# Altium project smart-watch.PrjPcb (part 1 of 2)
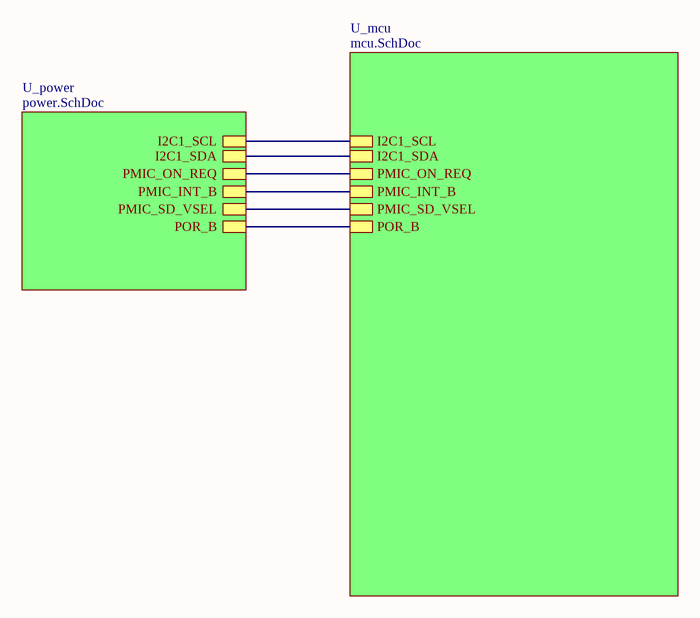
[diagram p0: smart-watch.SchDoc]
3 sheets, 82 parts. Net scope: hierarchical (ports join the sheet entries above them; power ports are global).
Board file: smart-watch.PcbDoc
Sheets:
  smart-watch.SchDoc
    U_mcu = mcu.SchDoc
    U_power = power.SchDoc

## Sheet smart-watch.SchDoc
size A4; SheetNumber: 1; SheetTotal: 3

### Sub-sheets
U_mcu = mcu.SchDoc: I2C1_SCL, I2C1_SDA, PMIC_ON_REQ, PMIC_INT_B, PMIC_SD_VSEL, POR_B
U_power = power.SchDoc: I2C1_SCL, I2C1_SDA, PMIC_ON_REQ, PMIC_INT_B, PMIC_SD_VSEL, POR_B

### Nets
I2C1_SCL: sheet U_mcu/I2C1_SCL, sheet U_power/I2C1_SCL
I2C1_SDA: sheet U_mcu/I2C1_SDA, sheet U_power/I2C1_SDA
NetR1_2: sheet U_mcu/PMIC_ON_REQ, sheet U_power/PMIC_ON_REQ
NetU1_AB3: sheet U_mcu/PMIC_SD_VSEL, sheet U_power/PMIC_SD_VSEL
NetU1_AB4: sheet U_mcu/PMIC_INT_B, sheet U_power/PMIC_INT_B
NetU1_Y3: sheet U_mcu/POR_B, sheet U_power/POR_B

### Notes on the sheet
- THIS DOCUMENT AND THE DATA DISCLOSED HEREIN OR
- HEREWITH IS THE PROPERTY OF ALTIUM LIMITED AND MAY
- DWG NO:
- REVISION
- REV:
- DESCRIPTION
- DATE
- APPROVED
- BE FREELY DISTRIBUTED IN WHOLE. NO RIGHTS ARE
- RESERVED OR EXPRESS OR IMPLIED WARANTEE GIVEN.
- ENG:
- APPROVALS
- PROJECT
- DSN:
- CHK:
- REFERENCE DOCUMENTS
- PROJECT REVISION:
- TITLE
- DOCUMENT REVISION:
- DESIGN ITEM:
- BOM:
- FAB DWG:
- PCB DWG:
- ASSY DWG:
- SCALE:
- A3
- SIZE
- CAGE CODE
- FILE NAME
- DWG NO.
- SHEET
- OF
- REV

## Sheet mcu.SchDoc
size A0; SheetNumber: 3; SheetTotal: 3
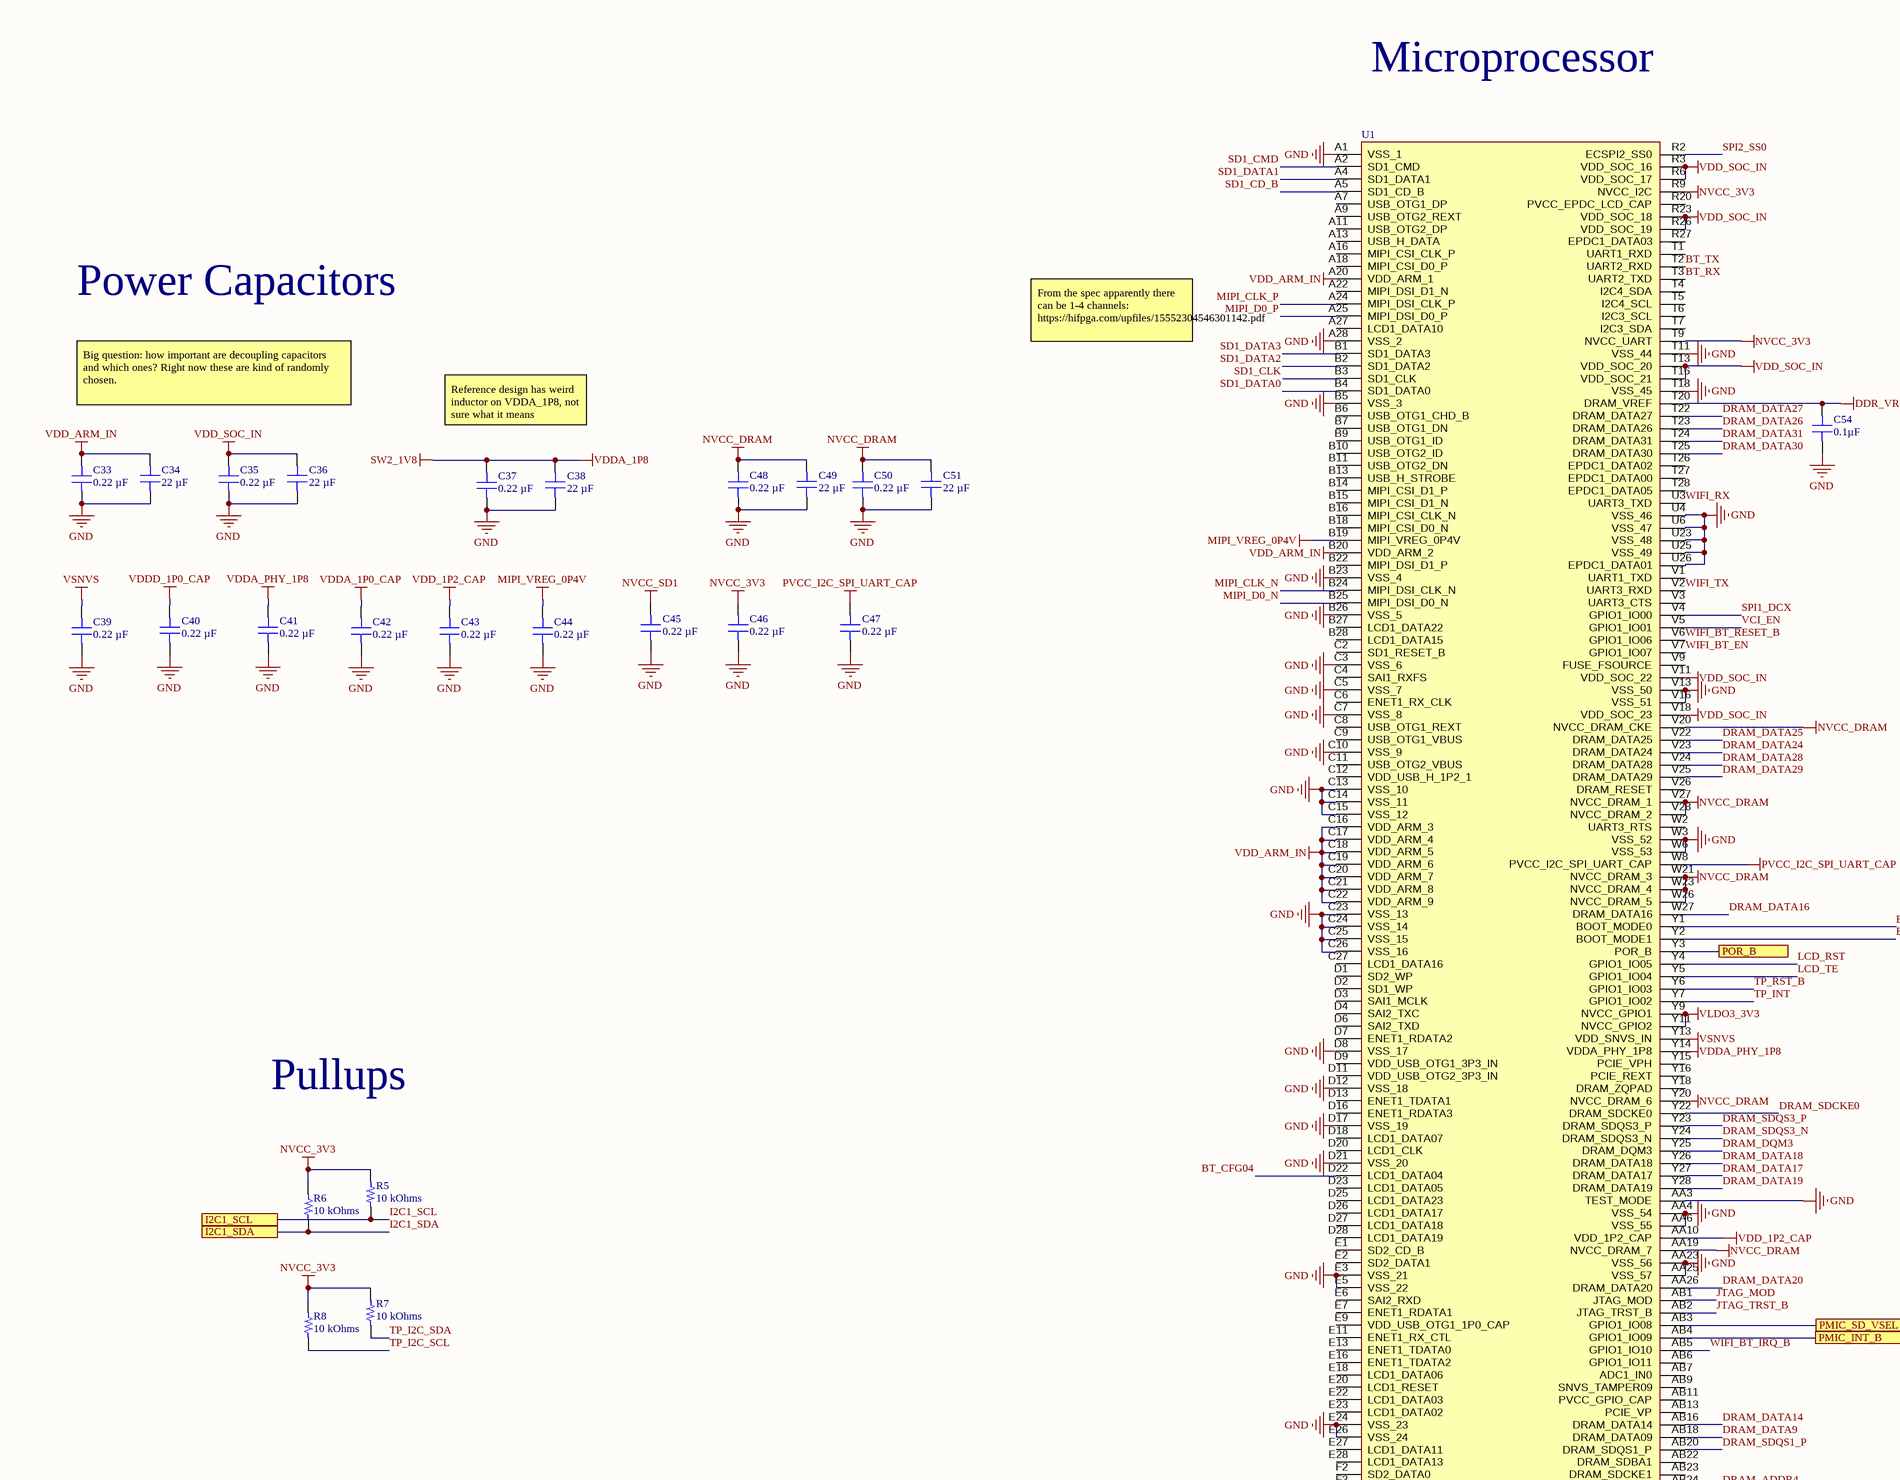
[diagram p1: mcu.SchDoc, top left]
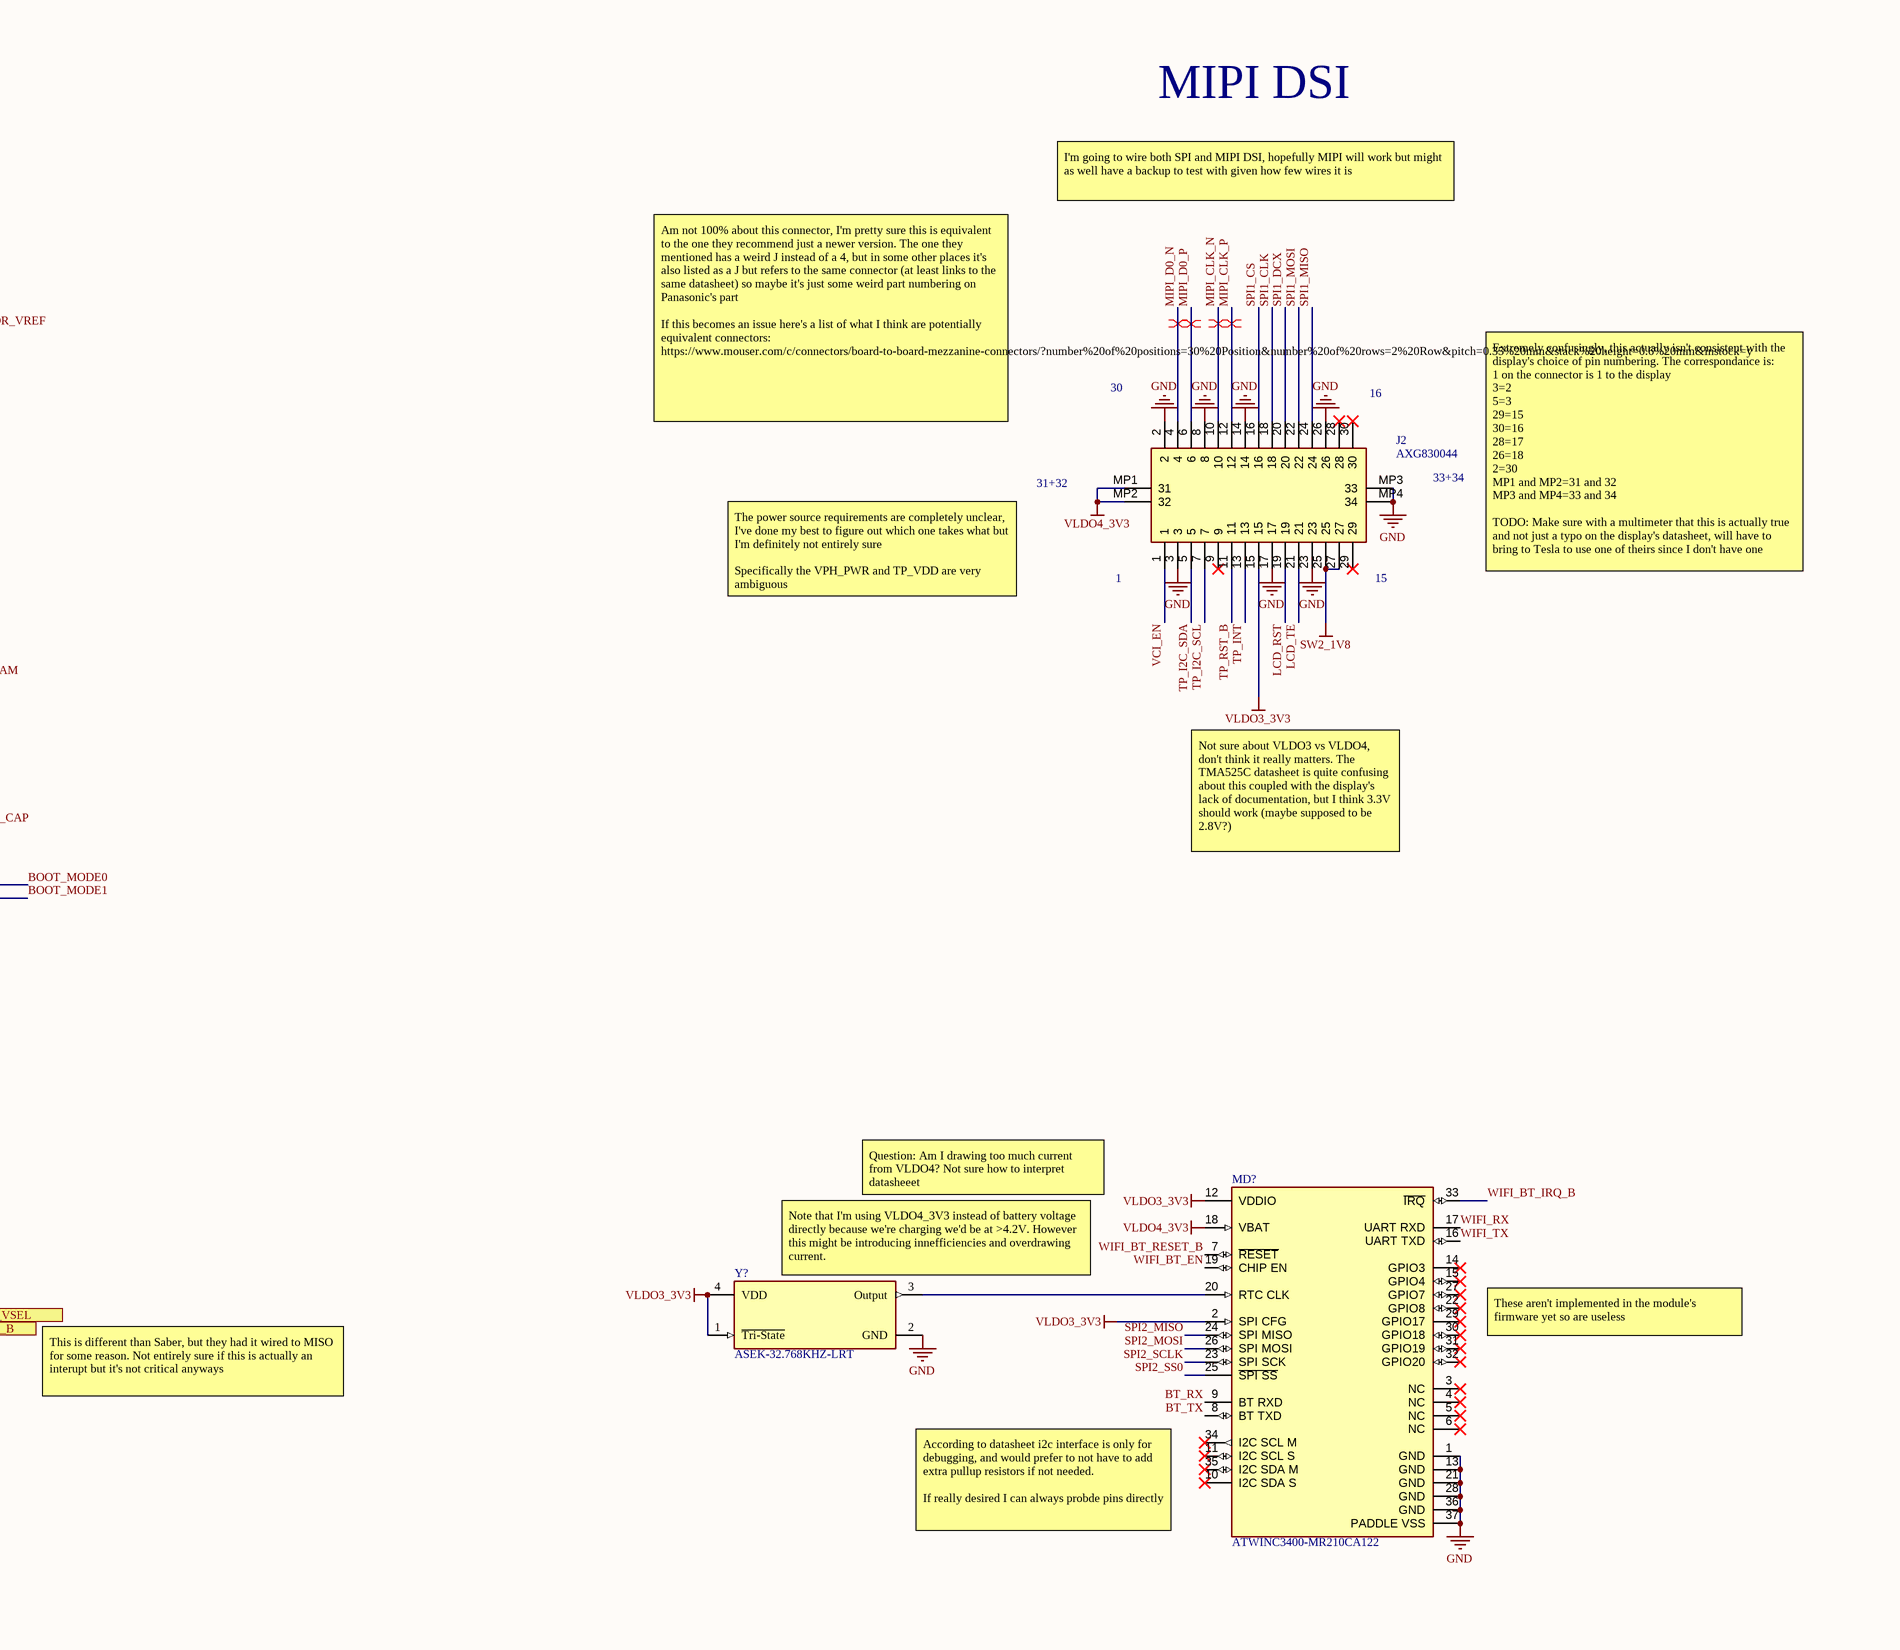
[diagram p2: mcu.SchDoc, top right]
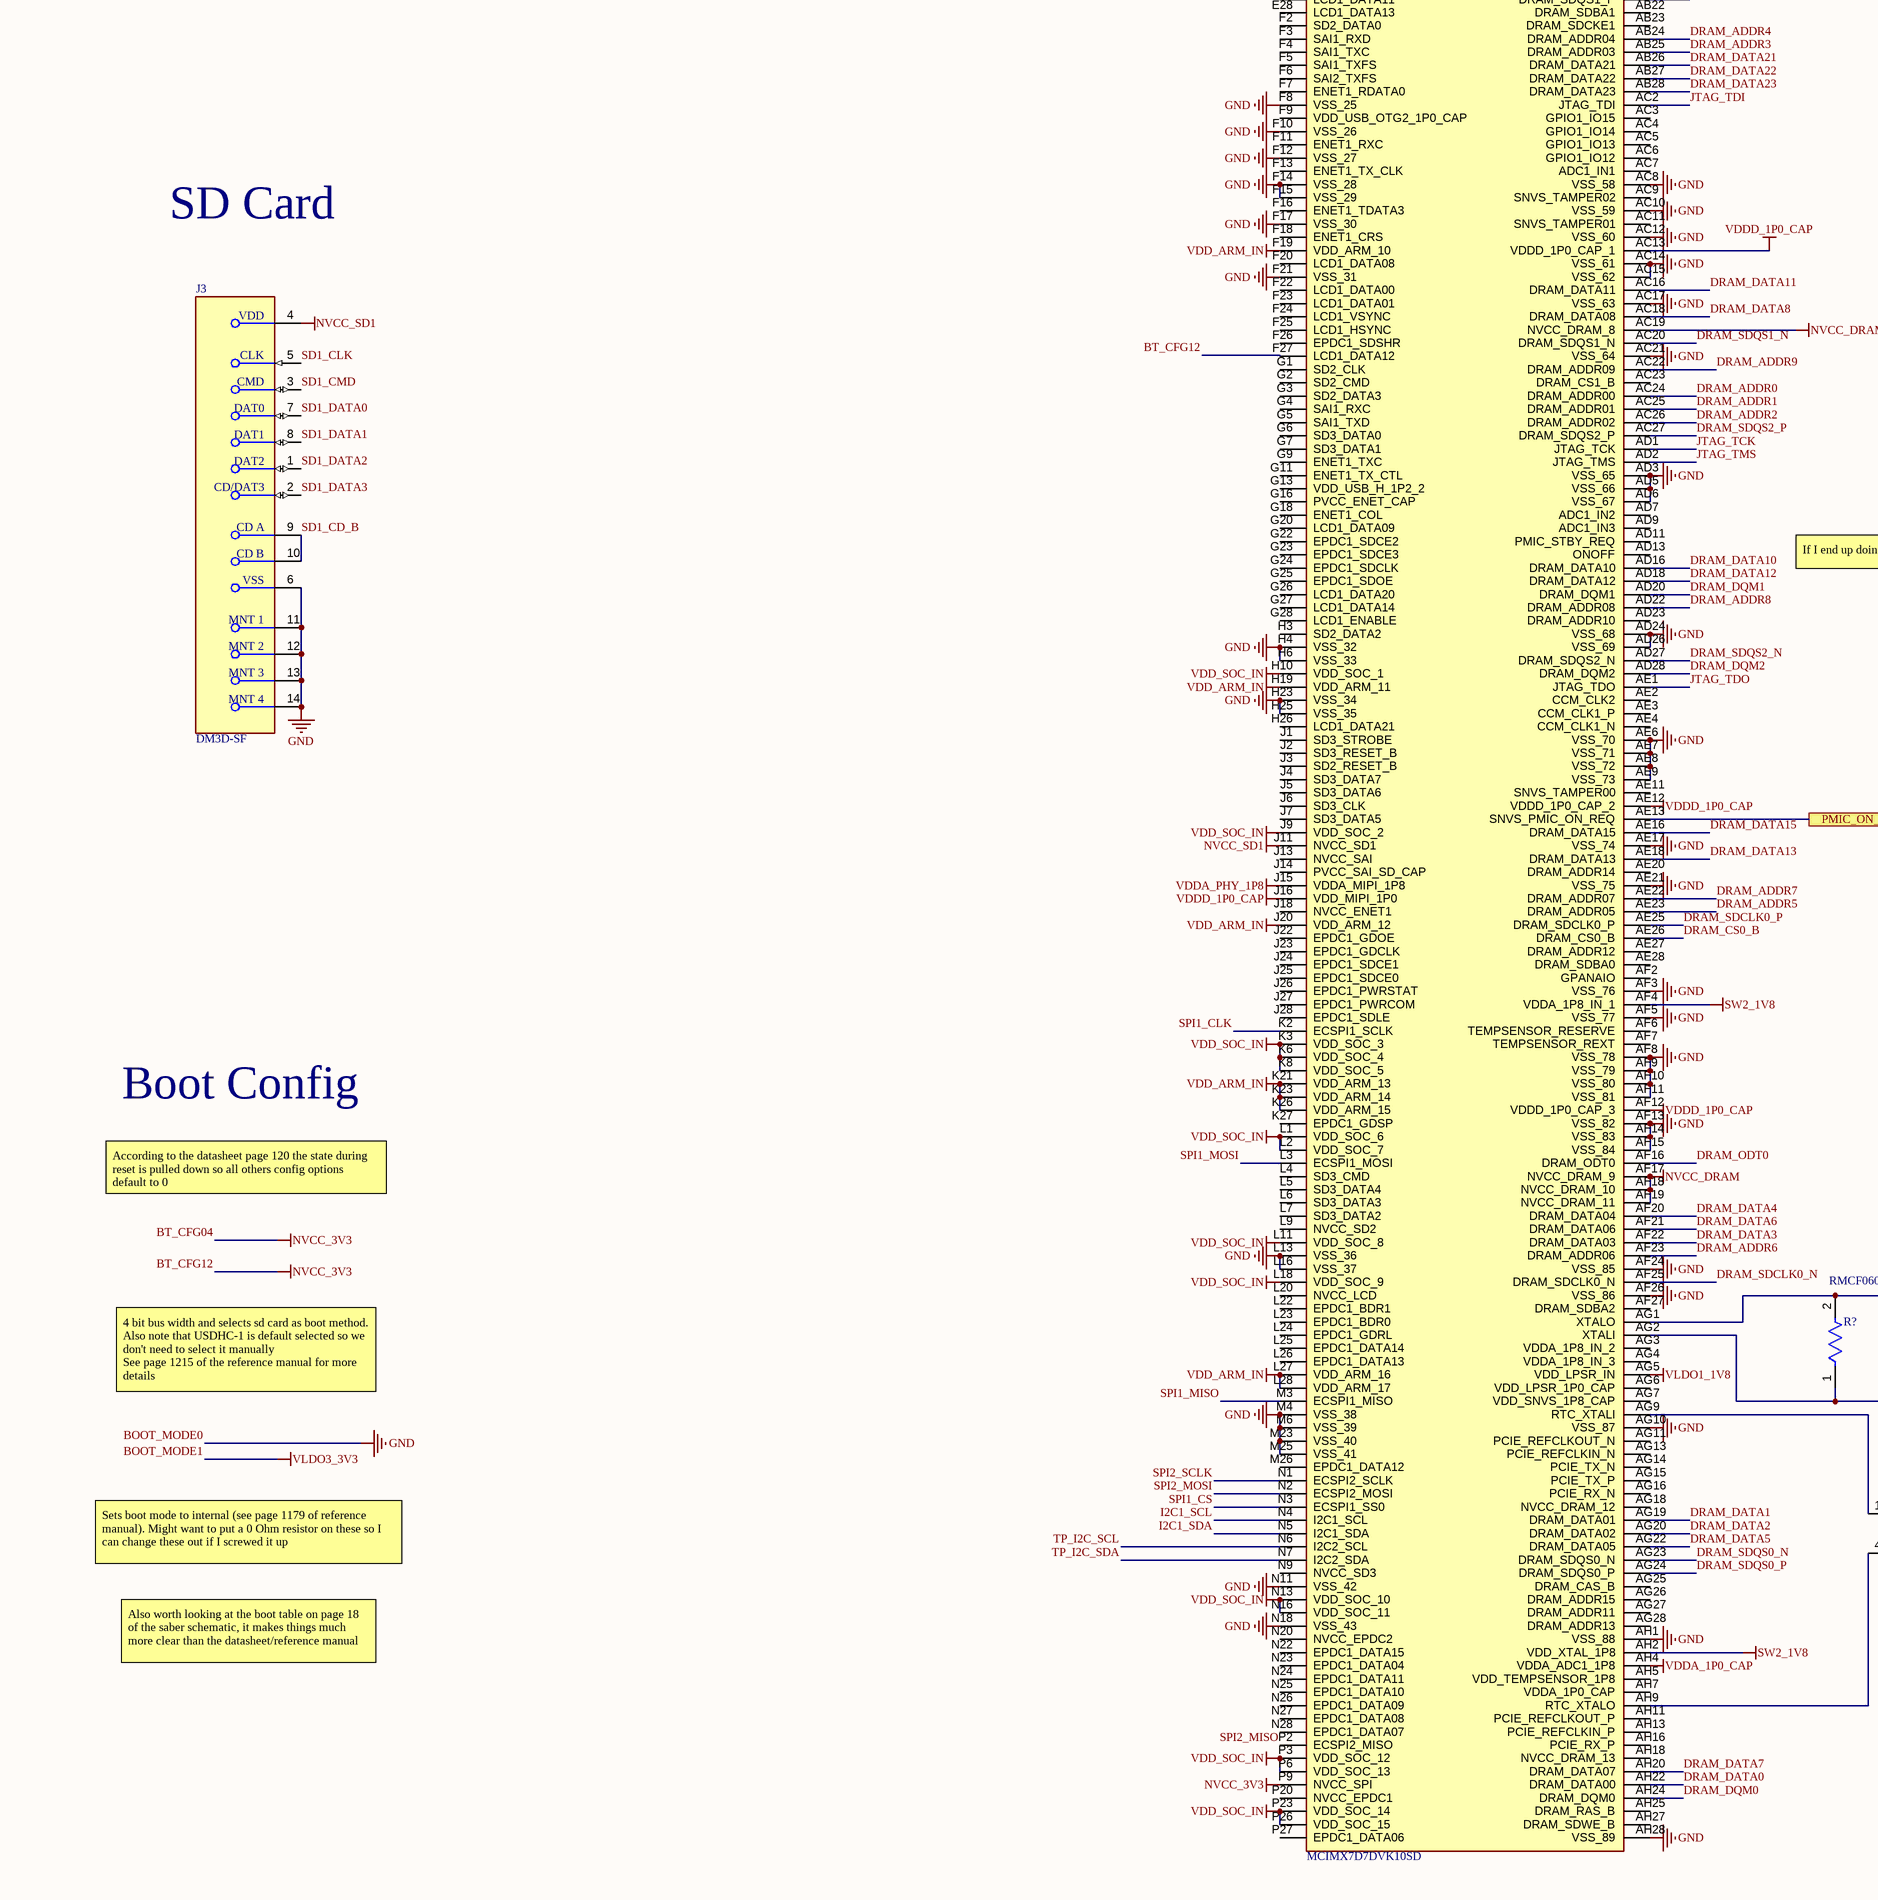
[diagram p3: mcu.SchDoc, bottom left]
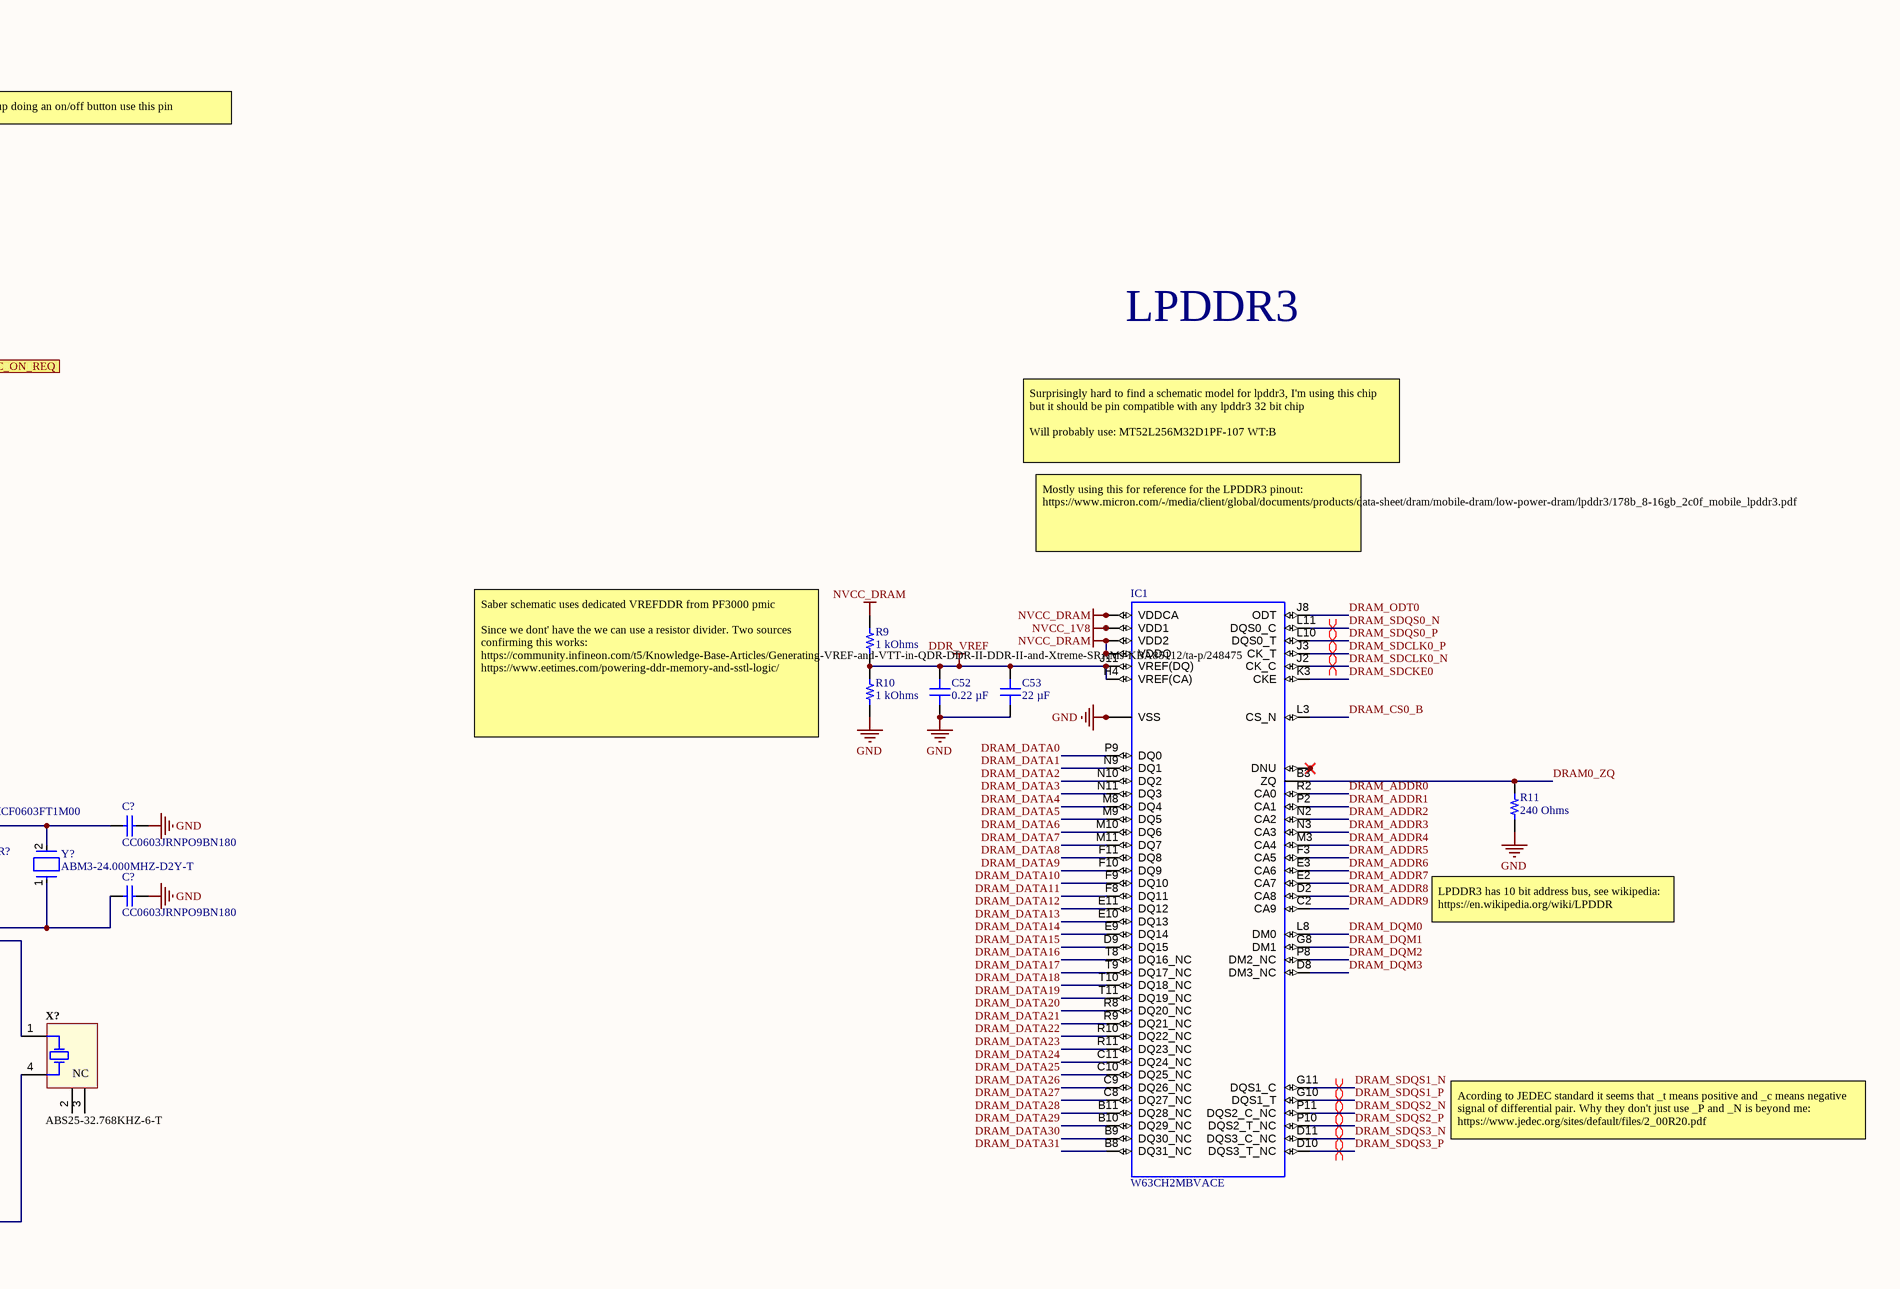
[diagram p4: mcu.SchDoc, bottom right]

### Parts
(Parts that share a designator on the sheet are numbered #1, #2 ... from top to bottom, then left to right.)
C33  0.22 µF  [CAP 0603_1608]
C34  22 µF  [CAP 0603_1608]
C35  0.22 µF  [CAP 0603_1608]
C36  22 µF  [CAP 0603_1608]
C37  0.22 µF  [CAP 0603_1608]
C38  22 µF  [CAP 0603_1608]
C39  0.22 µF  [CAP 0603_1608]
C40  0.22 µF  [CAP 0603_1608]
C41  0.22 µF  [CAP 0603_1608]
C42  0.22 µF  [CAP 0603_1608]
C43  0.22 µF  [CAP 0603_1608]
C44  0.22 µF  [CAP 0603_1608]
C45  0.22 µF  [CAP 0603_1608]
C46  0.22 µF  [CAP 0603_1608]
C47  0.22 µF  [CAP 0603_1608]
C48  0.22 µF  [CAP 0603_1608]
C49  22 µF  [CAP 0603_1608]
C50  0.22 µF  [CAP 0603_1608]
C51  22 µF  [CAP 0603_1608]
C52  0.22 µF  [CAP 0603_1608]
C53  22 µF  [CAP 0603_1608]
C54  0.1µF  [CAP 0603_1608]
C?#1  CC0603JRNPO9BN180  [CAPC1608X90X40LL10T20]
C?#2  CC0603JRNPO9BN180  [CAPC1608X90X40LL10T20]
IC1  W63CH2MBVACE  [W63CH2MBVACE]
J2  AXG830044  [AXG830044]
J3  DM3D-SF  [FP-DM3D-SF-MFG]
MD?  ATWINC3400-MR210CA122  [FP-ATWINC3400-MR210CA122-MFG]
R5  10 kOhms  [RES 0603_1608]
R6  10 kOhms  [RES 0603_1608]
R7  10 kOhms  [RES 0603_1608]
R8  10 kOhms  [RES 0603_1608]
R9  1 kOhms  [RES 0603_1608]
R10  1 kOhms  [RES 0603_1608]
R11  240 Ohms  [RES 0603_1608]
R?  RMCF0603FT1M00  [FP-RMCF0603-IPC_B]
U1  MCIMX7D7DVK10SD  [BGA488C40P28X28_1200X1200X110]
X?  ABS25-32.768KHZ-6-T  [ABRA-ABS25-4_V]
Y?#1  ASEK-32.768KHZ-LRT  [FP-ASEK-ASEAIG-MFG]
Y?#2  ABM3-24.000MHZ-D2Y-T  [FP-ABM3-MFG]

### Ports
I2C1_SCL, I2C1_SDA, PMIC_INT_B, PMIC_ON_REQ, PMIC_SD_VSEL, POR_B

### Nets
BOOT_MODE0: C33.1 C34.2 C35.1 C36.2 C37.1 C38.2 C39.1 C40.1 C41.1 C42.1 C43.1 C44.1 C45.1 C46.1 C47.1 C48.1 C49.2 C50.1 C51.2 C52.1 C53.2 C54.1 C?#1.2 C?#2.2 IC1.B2(VSS) IC1.B5(VSS) IC1.B6(VSS) IC1.B12(VSS) IC1.C3(VSS) IC1.C5(VSS) IC1.C6(VSS) IC1.D3(VSS) IC1.D12(VSS) IC1.E4(VSS) IC1.E5(VSS) IC1.E6(VSS) IC1.F4(VSS) IC1.F5(VSS) IC1.F6(VSS) IC1.F12(VSS) IC1.G3(VSS) IC1.G4(VSS) IC1.G6(VSS) IC1.G9(VSS) IC1.H2(VSS) IC1.H10(VSS) IC1.J4(VSS) IC1.J12(VSS) IC1.K2(VSS) IC1.K10(VSS) IC1.L6(VSS) IC1.L9(VSS) IC1.M4(VSS) IC1.M5(VSS) IC1.M6(VSS) IC1.M12(VSS) IC1.N4(VSS) IC1.N5(VSS) IC1.N6(VSS) IC1.P3(VSS) IC1.P12(VSS) IC1.R4(VSS) IC1.R5(VSS) IC1.R6(VSS) IC1.T2(VSS) IC1.T3(VSS) IC1.T4(VSS) IC1.T5(VSS) IC1.T6(VSS) IC1.T12(VSS) J2.2 J2.3 J2.8 J2.14 J2.17 J2.23 J2.26 J2.MP3(33) J2.MP4(34) J3.6(VSS) J3.11(MNT_1) J3.12(MNT_2) J3.13(MNT_3) J3.14(MNT_4) MD?.1(GND) MD?.13(GND) MD?.21(GND) MD?.28(GND) MD?.36(GND) MD?.37(PADDLE_VSS) R10.1 R11.1 U1.A1(VSS_1) U1.A28(VSS_2) U1.AA3(TEST_MODE) U1.AA4(VSS_54) U1.AA6(VSS_55) U1.AA23(VSS_56) U1.AA25(VSS_57) U1.AC8(VSS_58) U1.AC10(VSS_59) U1.AC12(VSS_60) U1.AC14(VSS_61) U1.AC15(VSS_62) U1.AC17(VSS_63) U1.AC21(VSS_64) U1.AD3(VSS_65) U1.AD5(VSS_66) U1.AD6(VSS_67) U1.AD24(VSS_68) U1.AD26(VSS_69) U1.AE6(VSS_70) U1.AE7(VSS_71) U1.AE8(VSS_72) U1.AE9(VSS_73) U1.AE17(VSS_74) U1.AE21(VSS_75) U1.AF3(VSS_76) U1.AF5(VSS_77) U1.AF8(VSS_78) U1.AF9(VSS_79) U1.AF10(VSS_80) U1.AF11(VSS_81) U1.AF13(VSS_82) U1.AF14(VSS_83) U1.AF15(VSS_84) U1.AF24(VSS_85) U1.AF26(VSS_86) U1.AG10(VSS_87) U1.AH1(VSS_88) U1.AH28(VSS_89) U1.B5(VSS_3) U1.B23(VSS_4) U1.B26(VSS_5) U1.C3(VSS_6) U1.C5(VSS_7) U1.C7(VSS_8) U1.C10(VSS_9) U1.C13(VSS_10) U1.C14(VSS_11) U1.C15(VSS_12) U1.C23(VSS_13) U1.C24(VSS_14) U1.C25(VSS_15) U1.C26(VSS_16) U1.D8(VSS_17) U1.D12(VSS_18) U1.D17(VSS_19) U1.D21(VSS_20) U1.E3(VSS_21) U1.E5(VSS_22) U1.E24(VSS_23) U1.E26(VSS_24) U1.F8(VSS_25) U1.F10(VSS_26) U1.F12(VSS_27) U1.F14(VSS_28) U1.F15(VSS_29) U1.F17(VSS_30) U1.F21(VSS_31) U1.H4(VSS_32) U1.H6(VSS_33) U1.H23(VSS_34) U1.H25(VSS_35) U1.L13(VSS_36) U1.L16(VSS_37) U1.M4(VSS_38) U1.M6(VSS_39) U1.M23(VSS_40) U1.M25(VSS_41) U1.N11(VSS_42) U1.N18(VSS_43) U1.T11(VSS_44) U1.T18(VSS_45) U1.U4(VSS_46) U1.U6(VSS_47) U1.U23(VSS_48) U1.U25(VSS_49) U1.U26(EPDC1_DATA01) U1.V13(VSS_50) U1.V16(VSS_51) U1.W3(VSS_52) U1.W6(VSS_53) U1.Y1(BOOT_MODE0) Y?#1.2(GND)  [also labelled GND]
BOOT_MODE1: J2.15 MD?.2(SPI_CFG) MD?.12(VDDIO) U1.Y2(BOOT_MODE1) U1.Y9(NVCC_GPIO1) U1.Y11(NVCC_GPIO2) Y?#1.1(~{Tri-State}) Y?#1.4(VDD)  [also labelled VLDO3_3V3]
BT_CFG04: C46.2 R5.2 R6.2 R7.2 R8.2 U1.D22(LCD1_DATA04) U1.F27(LCD1_DATA12) U1.P9(NVCC_SPI) U1.R9(NVCC_I2C) U1.T9(NVCC_UART)  [also labelled BT_CFG12, NVCC_3V3]
DDR_VREF: C52.2 C53.1 C54.2 IC1.H4(VREF(CA)) IC1.J11(VREF(DQ)) R9.1 R10.2 U1.T20(DRAM_VREF)
MIPI_VREG_0P4V: C44.2 U1.B19(MIPI_VREG_0P4V)
NVCC_1V8: C37.2 C38.1 IC1.A3(VDD1) IC1.A4(VDD1) IC1.A5(VDD1) IC1.A6(VDD1) IC1.A10(VDD1) IC1.U3(VDD1) IC1.U4(VDD1) IC1.U5(VDD1) IC1.U6(VDD1) IC1.U10(VDD1) J2.25 J2.27 U1.AF4(VDDA_1P8_IN_1) U1.AH2(VDD_XTAL_1P8)  [also labelled SW2_1V8, VDDA_1P8]
NVCC_DRAM: C48.2 C49.1 C50.2 C51.1 IC1.A8(VDD2) IC1.A9(VDD2) IC1.A11(VDDQ) IC1.C12(VDDQ) IC1.D4(VDD2) IC1.D5(VDD2) IC1.D6(VDD2) IC1.E8(VDDQ) IC1.E12(VDDQ) IC1.F2(VDDCA) IC1.G2(VDDCA) IC1.G5(VDD2) IC1.G12(VDDQ) IC1.H3(VDDCA) IC1.H5(VDD2) IC1.H6(VDD2) IC1.H8(VDDQ) IC1.H9(VDDQ) IC1.H11(VDDQ) IC1.H12(VDD2) IC1.J5(VDD2) IC1.J6(VDD2) IC1.J9(VDDQ) IC1.J10(VDDQ) IC1.K5(VDD2) IC1.K6(VDD2) IC1.K8(VDDQ) IC1.K11(VDDQ) IC1.K12(VDD2) IC1.L2(VDDCA) IC1.L5(VDD2) IC1.L12(VDDQ) IC1.M2(VDDCA) IC1.N8(VDDQ) IC1.N12(VDDQ) IC1.P4(VDD2) IC1.P5(VDD2) IC1.P6(VDD2) IC1.R12(VDDQ) IC1.U8(VDD2) IC1.U9(VDD2) IC1.U11(VDDQ) R9.2 U1.AA19(NVCC_DRAM_7) U1.AC19(NVCC_DRAM_8) U1.AF17(NVCC_DRAM_9) U1.AF18(NVCC_DRAM_10) U1.AF19(NVCC_DRAM_11) U1.V20(NVCC_DRAM_CKE) U1.V27(NVCC_DRAM_1) U1.V28(NVCC_DRAM_2) U1.W21(NVCC_DRAM_3) U1.W23(NVCC_DRAM_4) U1.W26(NVCC_DRAM_5) U1.Y20(NVCC_DRAM_6)
NVCC_SD1: C45.2 J3.4(VDD) U1.J11(NVCC_SD1)
PVCC_I2C_SPI_UART_CAP: C47.2 U1.W8(PVCC_I2C_SPI_UART_CAP)
VDD_1P2_CAP: C43.2 U1.AA10(VDD_1P2_CAP)
VDD_ARM_IN: C33.2 C34.1 C35.2 C36.1 U1.A20(VDD_ARM_1) U1.B20(VDD_ARM_2) U1.C16(VDD_ARM_3) U1.C17(VDD_ARM_4) U1.C18(VDD_ARM_5) U1.C19(VDD_ARM_6) U1.C20(VDD_ARM_7) U1.C21(VDD_ARM_8) U1.C22(VDD_ARM_9) U1.F19(VDD_ARM_10) U1.H10(VDD_SOC_1) U1.H19(VDD_ARM_11) U1.J9(VDD_SOC_2) U1.J20(VDD_ARM_12) U1.K3(VDD_SOC_3) U1.K6(VDD_SOC_4) U1.K8(VDD_SOC_5) U1.K21(VDD_ARM_13) U1.K23(VDD_ARM_14) U1.K26(VDD_ARM_15) U1.L1(VDD_SOC_6) U1.L2(VDD_SOC_7) U1.L11(VDD_SOC_8) U1.L18(VDD_SOC_9) U1.L27(VDD_ARM_16) U1.L28(VDD_ARM_17) U1.N13(VDD_SOC_10) U1.N16(VDD_SOC_11) U1.P3(VDD_SOC_12) U1.P6(VDD_SOC_13) U1.P23(VDD_SOC_14) U1.P26(VDD_SOC_15) U1.R3(VDD_SOC_16) U1.R6(VDD_SOC_17) U1.R23(VDD_SOC_18) U1.R26(VDD_SOC_19) U1.T13(VDD_SOC_20) U1.T16(VDD_SOC_21) U1.V11(VDD_SOC_22) U1.V18(VDD_SOC_23)  [also labelled VDD_SOC_IN]  [project net SW1_1V1]
VDDA_1P0_CAP: C42.2 U1.AH4(VDDA_ADC1_1P8)
VDDA_PHY_1P8: C41.2 U1.J15(VDDA_MIPI_1P8) U1.Y14(VDDA_PHY_1P8)
VDDD_1P0_CAP: C40.2 U1.AC13(VDDD_1P0_CAP_1) U1.AE12(VDDD_1P0_CAP_2) U1.AF12(VDDD_1P0_CAP_3) U1.J16(VDD_MIPI_1P0)
VLDO1_1V8: U1.AG5(VDD_LPSR_IN)
VLDO4_3V3: J2.MP1(31) J2.MP2(32) MD?.18(VBAT)
VSNVS: C39.2 U1.Y13(VDD_SNVS_IN)
BT_RX: MD?.9(BT_RXD) U1.T3(UART2_TXD)
BT_TX: MD?.8(BT_TXD) U1.T2(UART2_RXD)
DRAM0_ZQ: IC1.B3(ZQ) R11.2
DRAM_ADDR0: IC1.R2(CA0) U1.AC24(DRAM_ADDR00)
DRAM_ADDR1: IC1.P2(CA1) U1.AC25(DRAM_ADDR01)
DRAM_ADDR2: IC1.N2(CA2) U1.AC26(DRAM_ADDR02)
DRAM_ADDR3: IC1.N3(CA3) U1.AB25(DRAM_ADDR03)
DRAM_ADDR4: IC1.M3(CA4) U1.AB24(DRAM_ADDR04)
DRAM_ADDR5: IC1.F3(CA5) U1.AE23(DRAM_ADDR05)
DRAM_ADDR6: IC1.E3(CA6) U1.AF23(DRAM_ADDR06)
DRAM_ADDR7: IC1.E2(CA7) U1.AE22(DRAM_ADDR07)
DRAM_ADDR8: IC1.D2(CA8) U1.AD22(DRAM_ADDR08)
DRAM_ADDR9: IC1.C2(CA9) U1.AC22(DRAM_ADDR09)
DRAM_CS0_B: IC1.L3(CS_N) U1.AE26(DRAM_CS0_B)
DRAM_DATA0: IC1.P9(DQ0) U1.AH22(DRAM_DATA00)
DRAM_DATA1: IC1.N9(DQ1) U1.AG19(DRAM_DATA01)
DRAM_DATA2: IC1.N10(DQ2) U1.AG20(DRAM_DATA02)
DRAM_DATA3: IC1.N11(DQ3) U1.AF22(DRAM_DATA03)
DRAM_DATA4: IC1.M8(DQ4) U1.AF20(DRAM_DATA04)
DRAM_DATA5: IC1.M9(DQ5) U1.AG22(DRAM_DATA05)
DRAM_DATA6: IC1.M10(DQ6) U1.AF21(DRAM_DATA06)
DRAM_DATA7: IC1.M11(DQ7) U1.AH20(DRAM_DATA07)
DRAM_DATA8: IC1.F11(DQ8) U1.AC18(DRAM_DATA08)
DRAM_DATA9: IC1.F10(DQ9) U1.AB18(DRAM_DATA09)
DRAM_DATA10: IC1.F9(DQ10) U1.AD16(DRAM_DATA10)
DRAM_DATA11: IC1.F8(DQ11) U1.AC16(DRAM_DATA11)
DRAM_DATA12: IC1.E11(DQ12) U1.AD18(DRAM_DATA12)
DRAM_DATA13: IC1.E10(DQ13) U1.AE18(DRAM_DATA13)
DRAM_DATA14: IC1.E9(DQ14) U1.AB16(DRAM_DATA14)
DRAM_DATA15: IC1.D9(DQ15) U1.AE16(DRAM_DATA15)
DRAM_DATA16: IC1.T8(DQ16_NC) U1.W27(DRAM_DATA16)
DRAM_DATA17: IC1.T9(DQ17_NC) U1.Y27(DRAM_DATA17)
DRAM_DATA18: IC1.T10(DQ18_NC) U1.Y26(DRAM_DATA18)
DRAM_DATA19: IC1.T11(DQ19_NC) U1.Y28(DRAM_DATA19)
DRAM_DATA20: IC1.R8(DQ20_NC) U1.AA26(DRAM_DATA20)
DRAM_DATA21: IC1.R9(DQ21_NC) U1.AB26(DRAM_DATA21)
DRAM_DATA22: IC1.R10(DQ22_NC) U1.AB27(DRAM_DATA22)
DRAM_DATA23: IC1.R11(DQ23_NC) U1.AB28(DRAM_DATA23)
DRAM_DATA24: IC1.C11(DQ24_NC) U1.V23(DRAM_DATA24)
DRAM_DATA25: IC1.C10(DQ25_NC) U1.V22(DRAM_DATA25)
DRAM_DATA26: IC1.C9(DQ26_NC) U1.T23(DRAM_DATA26)
DRAM_DATA27: IC1.C8(DQ27_NC) U1.T22(DRAM_DATA27)
DRAM_DATA28: IC1.B11(DQ28_NC) U1.V24(DRAM_DATA28)
DRAM_DATA29: IC1.B10(DQ29_NC) U1.V25(DRAM_DATA29)
DRAM_DATA30: IC1.B9(DQ30_NC) U1.T25(DRAM_DATA30)
DRAM_DATA31: IC1.B8(DQ31_NC) U1.T24(DRAM_DATA31)
DRAM_DQM0: IC1.L8(DM0) U1.AH24(DRAM_DQM0)
DRAM_DQM1: IC1.G8(DM1) U1.AD20(DRAM_DQM1)
DRAM_DQM2: IC1.P8(DM2_NC) U1.AD28(DRAM_DQM2)
DRAM_DQM3: IC1.D8(DM3_NC) U1.Y25(DRAM_DQM3)
DRAM_ODT0: IC1.J8(ODT) U1.AF16(DRAM_ODT0)
DRAM_SDCKE0: IC1.K3(CKE) U1.Y22(DRAM_SDCKE0)
DRAM_SDCLK0_N: IC1.J2(CK_C) U1.AF25(DRAM_SDCLK0_N)
DRAM_SDCLK0_P: IC1.J3(CK_T) U1.AE25(DRAM_SDCLK0_P)
DRAM_SDQS0_N: IC1.L11(DQS0_C) U1.AG23(DRAM_SDQS0_N)
DRAM_SDQS0_P: IC1.L10(DQS0_T) U1.AG24(DRAM_SDQS0_P)
DRAM_SDQS1_N: IC1.G11(DQS1_C) U1.AC20(DRAM_SDQS1_N)
DRAM_SDQS1_P: IC1.G10(DQS1_T) U1.AB20(DRAM_SDQS1_P)
DRAM_SDQS2_N: IC1.P11(DQS2_C_NC) U1.AD27(DRAM_SDQS2_N)
DRAM_SDQS2_P: IC1.P10(DQS2_T_NC) U1.AC27(DRAM_SDQS2_P)
DRAM_SDQS3_N: IC1.D11(DQS3_C_NC) U1.Y24(DRAM_SDQS3_N)
DRAM_SDQS3_P: IC1.D10(DQS3_T_NC) U1.Y23(DRAM_SDQS3_P)
I2C1_SCL: R5.1 U1.N4(I2C1_SCL) ; port I2C1_SCL
I2C1_SDA: R6.1 U1.N5(I2C1_SDA) ; port I2C1_SDA
JTAG_MOD: U1.AB1(JTAG_MOD)
JTAG_TCK: U1.AD1(JTAG_TCK)
JTAG_TDI: U1.AC2(JTAG_TDI)
JTAG_TDO: U1.AE1(JTAG_TDO)
JTAG_TMS: U1.AD2(JTAG_TMS)
JTAG_TRST_B: U1.AB2(JTAG_TRST_B)
LCD_RST: J2.19 U1.Y4(GPIO1_IO05)
LCD_TE: J2.21 U1.Y5(GPIO1_IO04)
MIPI_CLK_N: J2.10 U1.B24(MIPI_DSI_CLK_N)
MIPI_CLK_P: J2.12 U1.A24(MIPI_DSI_CLK_P)
MIPI_D0_N: J2.4 U1.B25(MIPI_DSI_D0_N)
MIPI_D0_P: J2.6 U1.A25(MIPI_DSI_D0_P)
SD1_CD_B: J3.9(CD_A) J3.10(CD_B) U1.A5(SD1_CD_B)
SD1_CLK: J3.5(CLK) U1.B3(SD1_CLK)
SD1_CMD: J3.3(CMD) U1.A2(SD1_CMD)
SD1_DATA0: J3.7(DAT0) U1.B4(SD1_DATA0)
SD1_DATA1: J3.8(DAT1) U1.A4(SD1_DATA1)
SD1_DATA2: J3.1(DAT2) U1.B2(SD1_DATA2)
SD1_DATA3: J3.2(CD/DAT3) U1.B1(SD1_DATA3)
SPI1_CLK: J2.18 U1.K2(ECSPI1_SCLK)
SPI1_CS: J2.16 U1.N3(ECSPI1_SS0)
SPI1_DCX: J2.20 U1.V4(GPIO1_IO00)
SPI1_MISO: J2.24 U1.M3(ECSPI1_MISO)
SPI1_MOSI: J2.22 U1.L3(ECSPI1_MOSI)
SPI2_MISO: MD?.24(SPI_MISO) U1.P2(ECSPI2_MISO)
SPI2_MOSI: MD?.26(SPI_MOSI) U1.N2(ECSPI2_MOSI)
SPI2_SCLK: MD?.23(SPI_SCK) U1.N1(ECSPI2_SCLK)
SPI2_SS0: MD?.25(~{SPI_SS}) U1.R2(ECSPI2_SS0)
TP_I2C_SCL: J2.7 R8.1 U1.N6(I2C2_SCL)
TP_I2C_SDA: J2.5 R7.1 U1.N7(I2C2_SDA)
TP_INT: J2.13 U1.Y7(GPIO1_IO02)
TP_RST_B: J2.11 U1.Y6(GPIO1_IO03)
VCI_EN: J2.1 U1.V5(GPIO1_IO01)
WIFI_BT_EN: MD?.19(CHIP_EN) U1.V7(GPIO1_IO07)
WIFI_BT_IRQ_B: MD?.33(~{IRQ}) U1.AB5(GPIO1_IO10)
WIFI_BT_RESET_B: MD?.7(~{RESET}) U1.V6(GPIO1_IO06)
WIFI_RX: MD?.17(UART_RXD) U1.U3(UART3_TXD)
WIFI_TX: MD?.16(UART_TXD) U1.V2(UART3_RXD)
NetC?#1_1: C?#1.1 R?.2 U1.AG1(XTALO) Y?#2.2
NetC?#2_1: C?#2.1 R?.1 U1.AG2(XTALI) Y?#2.1
NetIC1_A1: IC1.A1(DNU) IC1.A2(DNU) IC1.A12(DNU) IC1.A13(DNU) IC1.B1(DNU) IC1.B13(DNU) IC1.T1(DNU) IC1.T13(DNU) IC1.U1(DNU) IC1.U2(DNU) IC1.U12(DNU) IC1.U13(DNU)
NetMD?_20: MD?.20(RTC_CLK) Y?#1.3(Output)
NetR1_2: U1.AE13(SNVS_PMIC_ON_REQ) ; port PMIC_ON_REQ
NetU1_AB3: U1.AB3(GPIO1_IO08) ; port PMIC_SD_VSEL
NetU1_AB4: U1.AB4(GPIO1_IO09) ; port PMIC_INT_B
NetU1_AG9: U1.AG9(RTC_XTALI) X?.1(X1)
NetU1_AH9: U1.AH9(RTC_XTALO) X?.4(X2)
NetU1_Y3: U1.Y3(POR_B) ; port POR_B

Not connected (* = marked no-connect by the designer): J2 9* 28* 29* 30*; MD? 3(NC)* 4(NC)* 5(NC)* 6(NC)* 10(I2C_SDA_S)* 11(I2C_SCL_S)* 14(GPIO3)* 15(GPIO4)* 22(GPIO8)* 27(GPIO7)* 29(GPIO17)* 30(GPIO18)* 31(GPIO19)* 32(GPIO20)* 34(I2C_SCL_M)* 35(I2C_SDA_M)*; U1 A7(USB_OTG1_DP) A9(USB_OTG2_REXT) A11(USB_OTG2_DP) A13(USB_H_DATA) A16(MIPI_CSI_CLK_P) A18(MIPI_CSI_D0_P) A22(MIPI_DSI_D1_N) A27(LCD1_DATA10) AB6(GPIO1_IO11) AB7(ADC1_IN0) AB9(SNVS_TAMPER09) AB11(PVCC_GPIO_CAP) AB13(PCIE_VP) AB22(DRAM_SDBA1) AB23(DRAM_SDCKE1) AC3(GPIO1_IO15) AC4(GPIO1_IO14) AC5(GPIO1_IO13) AC6(GPIO1_IO12) AC7(ADC1_IN1) AC9(SNVS_TAMPER02) AC11(SNVS_TAMPER01) AC23(DRAM_CS1_B) AD7(ADC1_IN2) AD9(ADC1_IN3) AD11(PMIC_STBY_REQ) AD13(ONOFF) AD23(DRAM_ADDR10) AE2(CCM_CLK2) AE3(CCM_CLK1_P) AE4(CCM_CLK1_N) AE11(SNVS_TAMPER00) AE20(DRAM_ADDR14) AE27(DRAM_ADDR12) AE28(DRAM_SDBA0) AF2(GPANAIO) AF6(TEMPSENSOR_RESERVE) AF7(TEMPSENSOR_REXT) AF27(DRAM_SDBA2) AG3(VDDA_1P8_IN_2) AG4(VDDA_1P8_IN_3) AG6(VDD_LPSR_1P0_CAP) AG7(VDD_SNVS_1P8_CAP) AG11(PCIE_REFCLKOUT_N) AG13(PCIE_REFCLKIN_N) AG14(PCIE_TX_N) AG15(PCIE_TX_P) AG16(PCIE_RX_N) AG18(NVCC_DRAM_12) AG25(DRAM_CAS_B) AG26(DRAM_ADDR15) AG27(DRAM_ADDR11) AG28(DRAM_ADDR13) AH5(VDD_TEMPSENSOR_1P8) AH7(VDDA_1P0_CAP) AH11(PCIE_REFCLKOUT_P) AH13(PCIE_REFCLKIN_P) AH16(PCIE_RX_P) AH18(NVCC_DRAM_13) AH25(DRAM_RAS_B) AH27(DRAM_SDWE_B) B6(USB_OTG1_CHD_B) B7(USB_OTG1_DN) B9(USB_OTG1_ID) B10(USB_OTG2_ID) B11(USB_OTG2_DN) B13(USB_H_STROBE) B14(MIPI_CSI_D1_P) B15(MIPI_CSI_D1_N) B16(MIPI_CSI_CLK_N) B18(MIPI_CSI_D0_N) B22(MIPI_DSI_D1_P) B27(LCD1_DATA22) B28(LCD1_DATA15) C2(SD1_RESET_B) C4(SAI1_RXFS) C6(ENET1_RX_CLK) C8(USB_OTG1_REXT) C9(USB_OTG1_VBUS) C11(USB_OTG2_VBUS) C12(VDD_USB_H_1P2_1) C27(LCD1_DATA16) D1(SD2_WP) D2(SD1_WP) D3(SAI1_MCLK) D4(SAI2_TXC) D6(SAI2_TXD) D7(ENET1_RDATA2) D9(VDD_USB_OTG1_3P3_IN) D11(VDD_USB_OTG2_3P3_IN) D13(ENET1_TDATA1) D16(ENET1_RDATA3) D18(LCD1_DATA07) D20(LCD1_CLK) D23(LCD1_DATA05) D25(LCD1_DATA23) D26(LCD1_DATA17) D27(LCD1_DATA18) D28(LCD1_DATA19) E1(SD2_CD_B) E2(SD2_DATA1) E6(SAI2_RXD) E7(ENET1_RDATA1) E9(VDD_USB_OTG1_1P0_CAP) E11(ENET1_RX_CTL) E13(ENET1_TDATA0) E16(ENET1_TDATA2) E18(LCD1_DATA06) E20(LCD1_RESET) E22(LCD1_DATA03) E23(LCD1_DATA02) E27(LCD1_DATA11) E28(LCD1_DATA13) F2(SD2_DATA0) F3(SAI1_RXD) F4(SAI1_TXC) F5(SAI1_TXFS) F6(SAI2_TXFS) F7(ENET1_RDATA0) F9(VDD_USB_OTG2_1P0_CAP) F11(ENET1_RXC) F13(ENET1_TX_CLK) F16(ENET1_TDATA3) F18(ENET1_CRS) F20(LCD1_DATA08) F22(LCD1_DATA00) F23(LCD1_DATA01) F24(LCD1_VSYNC) F25(LCD1_HSYNC) F26(EPDC1_SDSHR) G1(SD2_CLK) G2(SD2_CMD) G3(SD2_DATA3) G4(SAI1_RXC) G5(SAI1_TXD) G6(SD3_DATA0) G7(SD3_DATA1) G9(ENET1_TXC) G11(ENET1_TX_CTL) G13(VDD_USB_H_1P2_2) G16(PVCC_ENET_CAP) G18(ENET1_COL) G20(LCD1_DATA09) G22(EPDC1_SDCE2) G23(EPDC1_SDCE3) G24(EPDC1_SDCLK) G25(EPDC1_SDOE) G26(LCD1_DATA20) G27(LCD1_DATA14) G28(LCD1_ENABLE) H3(SD2_DATA2) H26(LCD1_DATA21) J1(SD3_STROBE) J2(SD3_RESET_B) J3(SD2_RESET_B) J4(SD3_DATA7) J5(SD3_DATA6) J6(SD3_CLK) J7(SD3_DATA5) J13(NVCC_SAI) J14(PVCC_SAI_SD_CAP) J18(NVCC_ENET1) J22(EPDC1_GDOE) J23(EPDC1_GDCLK) J24(EPDC1_SDCE1) J25(EPDC1_SDCE0) J26(EPDC1_PWRSTAT) J27(EPDC1_PWRCOM) J28(EPDC1_SDLE) K27(EPDC1_GDSP) L4(SD3_CMD) L5(SD3_DATA4) L6(SD3_DATA3) L7(SD3_DATA2) L9(NVCC_SD2) L20(NVCC_LCD) L22(EPDC1_BDR1) L23(EPDC1_BDR0) L24(EPDC1_GDRL) L25(EPDC1_DATA14) L26(EPDC1_DATA13) M26(EPDC1_DATA12) N9(NVCC_SD3) N20(NVCC_EPDC2) N22(EPDC1_DATA15) N23(EPDC1_DATA04) N24(EPDC1_DATA11) N25(EPDC1_DATA10) N26(EPDC1_DATA09) N27(EPDC1_DATA08) N28(EPDC1_DATA07) P20(NVCC_EPDC1) P27(EPDC1_DATA06) R20(PVCC_EPDC_LCD_CAP) R27(EPDC1_DATA03) T1(UART1_RXD) T4(I2C4_SDA) T5(I2C4_SCL) T6(I2C3_SCL) T7(I2C3_SDA) T26(EPDC1_DATA02) T27(EPDC1_DATA00) T28(EPDC1_DATA05) V1(UART1_TXD) V3(UART3_CTS) V9(FUSE_FSOURCE) V26(DRAM_RESET) W2(UART3_RTS) Y15(PCIE_VPH) Y16(PCIE_REXT) Y18(DRAM_ZQPAD); X? 2(NC) 3(NC)

### Layout directives
differential pair: DRAM_SDCLK0_N, DRAM_SDCLK0_P, DRAM_SDQS0_N, DRAM_SDQS0_P, DRAM_SDQS1_N, DRAM_SDQS1_P, DRAM_SDQS2_N, DRAM_SDQS2_P, DRAM_SDQS3_N, DRAM_SDQS3_P, MIPI_CLK_N, MIPI_CLK_P, MIPI_D0_N, MIPI_D0_P

### Notes on the sheet
- Microprocessor
- MIPI DSI
- Power Capacitors
- From the spec apparently there can be 1-4 channels:
  https://hifpga.com/upfiles/15552304546301142.pdf
- I'm going to wire both SPI and MIPI DSI, hopefully MIPI will work but might as well have a backup to test with given how few wires it is
- Big question: how important are decoupling capacitors and which ones? Right now these are kind of randomly chosen.
- Reference design has weird inductor on VDDA_1P8, not sure what it means
- Am not 100% about this connector, I'm pretty sure this is equivalent to the one they recommend just a newer version. The one they mentioned has a weird J instead of a 4, but in some other places it's also listed as a J but refers to the same connector (at least links to the same datasheet) so maybe it's just some weird part numbering on Panasonic's part
  If this becomes an issue here's a list of what I think are potentially equivalent connectors:
  https://www.mouser.com/c/connectors/board-to-board-mezzanine-connectors/?number%20of%20positions=30%20Position&number%20of%20rows=2%20Row&pitch=0.35%20mm&stack%20height=0.6%20mm&instock=y
- 30
- (near J2) 16
- 31+32
- 33+34
- The power source requirements are completely unclear, I've done my best to figure out which one takes what but I'm definitely not entirely sure
  Specifically the VPH_PWR and TP_VDD are very ambiguous
- (near J2) 1
- (near J2) 15
- Extremely confusingly, this actually isn't consistent with the display's choice of pin numbering. The correspondance is:
  1 on the connector is 1 to the display
  3=2
  5=3
  29=15
  30=16
  28=17
  26=18
  2=30
  MP1 and MP2=31 and 32
  MP3 and MP4=33 and 34
  TODO: Make sure with a multimeter that this is actually true and not just a typo on the display's datasheet, will have to bring to Tesla to use one of theirs since I don't have one
- Not sure about VLDO3 vs VLDO4, don't think it really matters. The TMA525C datasheet is quite confusing about this coupled with the display's lack of documentation, but I think 3.3V should work (maybe supposed to be 2.8V?)
- Pullups
- Question: Am I drawing too much current from VLDO4? Not sure how to interpret datasheeet
- (near Y?#1) Note that I'm using VLDO4_3V3 instead of battery voltage directly because we're charging we'd be at >4.2V. However this might be introducing innefficiencies and overdrawing current.
- This is different than Saber, but they had it wired to MISO for some reason. Not entirely sure if this is actually an interupt but it's not critical anyways
- These aren't implemented in the module's firmware yet so are useless
- According to datasheet i2c interface is only for debugging, and would prefer to not have to add extra pullup resistors if not needed.
  If really desired I can always probde pins directly
- SD Card
- If I end up doing an on/off button use this pin
- LPDDR3
- Surprisingly hard to find a schematic model for lpddr3, I'm using this chip but it should be pin compatible with any lpddr3 32 bit chip
  Will probably use: MT52L256M32D1PF-107 WT:B
- Mostly using this for reference for the LPDDR3 pinout:
  https://www.micron.com/-/media/client/global/documents/products/data-sheet/dram/mobile-dram/low-power-dram/lpddr3/178b_8-16gb_2c0f_mobile_lpddr3.pdf
- Boot Config
- According to the datasheet page 120 the state during reset is pulled down so all others config options default to 0
- Saber schematic uses dedicated VREFDDR from PF3000 pmic
  Since we dont' have the we can use a resistor divider. Two sources confirming this works:
  https://community.infineon.com/t5/Knowledge-Base-Articles/Generating-VREF-and-VTT-in-QDR-DDR-II-DDR-II-and-Xtreme-SRAMs-KBA85112/ta-p/248475
  https://www.eetimes.com/powering-ddr-memory-and-sstl-logic/
- 4 bit bus width and selects sd card as boot method. Also note that USDHC-1 is default selected so we don't need to select it manually
  See page 1215 of the reference manual for more details
- LPDDR3 has 10 bit address bus, see wikipedia:
  https://en.wikipedia.org/wiki/LPDDR
- Sets boot mode to internal (see page 1179 of reference manual). Might want to put a 0 Ohm resistor on these so I can change these out if I screwed it up
- Also worth looking at the boot table on page 18 of the saber schematic, it makes things much more clear than the datasheet/reference manual
- Acording to JEDEC standard it seems that _t means positive and _c means negative signal of differential pair. Why they don't just use _P and _N is beyond me:
  https://www.jedec.org/sites/default/files/2_00R20.pdf
- THIS DOCUMENT AND THE DATA DISCLOSED HEREIN OR
- HEREWITH IS THE PROPERTY OF ALTIUM LIMITED AND MAY
- DWG NO:
- REVISION
- REV:
- DESCRIPTION
- DATE
- APPROVED
- BE FREELY DISTRIBUTED IN WHOLE. NO RIGHTS ARE
- RESERVED OR EXPRESS OR IMPLIED WARANTEE GIVEN.
- ENG:
- APPROVALS
- PROJECT
- DSN:
- CHK:
- REFERENCE DOCUMENTS
- PROJECT REVISION:
- TITLE
- DOCUMENT REVISION:
- DESIGN ITEM:
- BOM:
- FAB DWG:
- PCB DWG:
- ASSY DWG:
- SCALE:
- A3
- SIZE
- CAGE CODE
- FILE NAME
- DWG NO.
- SHEET
- OF
- REV

### Library data of the parts
C33 C35 C37 C39-C48 C50 C52 = CC0603ZRY5V9BB224: CAP CER 0.22UF 50V Y5V 0603; manufacturer: Yageo; Temperature Coefficient: Y5V (F); Tolerance: -20%, +80%; Part Number: CC0603ZRY5V9BB224; Value: 0.22 µF; Applications: General Purpose; Capacitance: 0.22 µF; componentlink1description: Datasheet; componentlink1url: http://www.yageo.com/documents/recent/UPY-GPHC_Y5V_6.3V-to-50V_8.pdf; componentlink2description: DigiKey Link; componentlink2url: https://www.digikey.com/en/products/detail/yageo/CC0603ZRY5V9BB224/5195237; Device Package: 0603 (1608 Metric); lastupdated: 2022-05-23 12:54:43 PM; Lifecycle Status: Active; Minimum Order: 1; Mounting Type: Surface Mount, MLCC; Operating Temperature: -30°C ~ 85°C; Package / Case: 0603 (1608 Metric); packaging: TapeAndReel; partid: 12516; Part Status: Active; price: 0.02; series: CC; Size / Dimension: 0.063" L x 0.031" W (1.60mm x 0.80mm); Supplier 1: DigiKey; Supplier Part Number 1: 311-1830-1-ND; Thickness (Max): 0.035" (0.90mm); Voltage - Rated: 50V
C34 C36 C38 C49 C51 C53 = GRM188R60J226MEA0D: CAP CER 22UF 6.3V X5R 0603; manufacturer: Murata Electronics; Tolerance: ±20%; Part Number: GRM188R60J226MEA0D; Value: 22 µF; Applications: General Purpose; Capacitance: 22 µF; componentlink1description: Datasheet; componentlink1url: https://www.murata.com/~/media/webrenewal/support/library/catalog/products/capacitor/mlcc/c02e.ashx?la=en-us; componentlink2description: DigiKey Link; componentlink2url: https://www.digikey.com/en/products/detail/murata-electronics/GRM188R60J226MEA0D/4280542; Device Package: 0603 (1608 Metric); lastupdated: 2022-06-14 8:57:36 PM; Lifecycle Status: Active; Minimum Order: 1; Mounting Type: Surface Mount, MLCC; Operating Temperature: -55°C ~ 85°C; Package / Case: 0603 (1608 Metric); packaging: TapeAndReel; partid: 17945; Part Status: Active; price: 0.03; series: GRM; Size / Dimension: 0.063" L x 0.031" W (1.60mm x 0.80mm); Supplier 1: DigiKey; Supplier Part Number 1: 490-7611-1-ND; Temperature Coefficient: X5R; Thickness (Max): 0.039" (1.00mm); Voltage - Rated: 6.3V
C54 = 0603ZC104KAT2A: CAP CER 0.1UF 10V X7R 0603; manufacturer: AVX Corporation; Tolerance: ±10%; Part Number: 0603ZC104KAT2A; Value: 0.1µF; Applications: General Purpose; Capacitance: 0.1µF; componentlink1description: Datasheet; componentlink1url: http://datasheets.avx.com/X7RDielectric.pdf; componentlink2description: DigiKey Link; componentlink2url: http://digikey.com/product-detail/en/avx-corporation/0603ZC104KAT2A/478-7939-1-ND/3881562; Device Package: 0603 (1608 Metric); lastupdated: 2020-09-02 1:03:32 AM; Lifecycle Status: Active; Minimum Order: 1; Mounting Type: Surface Mount, MLCC; Operating Temperature: -55°C ~ 125°C; Package / Case: 0603 (1608 Metric); packaging: TapeAndReel; partid: 4385; Part Status: Active; price: 0.02; series: -; Size / Dimension: 0.063" L x 0.032" W (1.60mm x 0.81mm); Supplier 1: DigiKey; Supplier Part Number 1: 478-7939-1-ND; Temperature Coefficient: X7R; Thickness (Max): 0.035" (0.90mm); Voltage - Rated: 10V
C?#1 C?#2 = CMP-1659-00030-1: Chip Capacitor, 18 pF, +/- 5%, 50 V, -55 to 125 degC, 0603 (1608 Metric), RoHS, Tape and Reel; Voltage Rating: 50 V; Case\Package: 0603; Power Rating: 100 mW; Resistance: 68.1 Ohm; Tolerance: 1%; Case Code (Metric): 1608; Max Operating Temperature: 155 degC; RoHSCompliant: true; Case Code (Imperial): 0603; ComponentLink2Description: Datasheet; Package Quantity: 200; PackageReference: 0603; ComponentLink2URL: http://www.yageo.com/NewPortal/yageodocoutput?fileName=/pdf/MLCC/UPY-GP_NP0_16V-to-50V_14.pdf; Length: 1.6 mm; DatasheetVersion: Rev. 14, 07/2016; Min Operating Temperature: -55 degC; ComponentLink1URL: http://www.yageo.com/; Width: 0.8 mm; ComponentLink1Description: Manufacturer URL; Height: 0.45 mm; Radiation Hardening: No; PackageDescription: 2-Pin Surface Mount Device, Body 1.6 x 0.8 mm; Packaging: Tape and Reel
IC1 = W63CH2MBVACE: SDRAM - Mobile LPDDR3 Memory IC 4Gb (128M x 32) Parallel 933MHz 178-VFBGA (11x11.5); MF: Winbond Electronics; Package: VFBGA-178 Winbond Electronics; Value: *; Availability: Not in stock; SnapEDA_Link: https://www.snapeda.com/parts/W63CH2MBVACE/Winbond%20Electronics/view-part/4785003/?ref=snap; MP: W63CH2MBVACE; Price: None; Check_prices: https://www.snapeda.com/parts/W63CH2MBVACE/Winbond%20Electronics/view-part/4785003/?ref=eda
J2 = AXG830044: Connector; Manufacturer_Name: Panasonic; Datasheet Link: https://www.mouser.com/datasheet/2/315/con_eng_a35us-1299378.pdf; Height: 0.66mm; Manufacturer_Part_Number: AXG830044; Mouser Part Number: 769-AXG830044; Mouser Price/Stock: https://www.mouser.com/Search/Refine.aspx?Keyword=769-AXG830044
J3 = CMP-2000-06166-2: CONN MICRO SD CARD PUSH-PULL; Insulation Resistance: 1GR; Max Voltage Rating (AC): 125V; Gender: Female; Contact Resistance: 100mR; Current Rating: 500mA; Pitch: 1.1mm; Connector Type: Connector; Number of Contacts: 8; Contact Plating: Gold; Number of Rows: 1; Termination: Solder; Contact Material: Copper Alloy; REACH SVHC: No SVHC; Voltage Rating (AC): 125V; Packaging: Tape and Reel; Housing Material: Polymer; Max Operating Temperature: 85°C; Package Quantity: 1; Min Operating Temperature: -25°C; Lead Free: Lead Free; Orientation: Right Angle; Radiation Hardening: No; Flammability Rating: UL94 V-0; Mount: Surface Mount; Depth: 11.45mm; Max Current Rating: 500mA; Length: 11.95mm; Width: 11.95mm
MD? = CMP-06331-000014-1: WIRELESS MODULE; Manufacturer: Microchip; Receiving Current: 87mA; Interface: I2C,SPI,UART; Bandwidth: 60MHz; Transmitting Current: 256mA; Max Frequency: 2472MHz; Max Junction Temp: +125°C; Max Supply Voltage: 4.2V; Data Rate: 72.2Mbits/s; Number Of Gpio: 21; Sensitivity: -90dBm; Min Supply Voltage: 2.7V; Manufacturer Part Number: ATWINC3400-MR210CA122; Package: SMT_MODULE; Octopart: https://octopart.com/atwinc3400-mr210ca122-microchip-87693673; ComponentLink2Description: Datasheet; Digikey Description: WIRELESS MODULE; RoHS: TRUE; Lead Free: Yes; Automotive: No; ComponentLink2URL: http://ww1.microchip.com/downloads/en/DeviceDoc/IEEE-802.11-bgn-Network-Controller-with-Integrated-Bluetooth-Low-Energy-Module-Data-Sheet-DS70005350B.pdf; Device Class L2: RF Semiconductors and Devices; Height: 2.087mm; Temperature Range High: +85°C; Temperature Range Low: -40°C; Temperature: -40°C to +85°C; Mouser Description: WLAN+BTCombo Module IEEE 802.11b/g/n Bluetooth v4.0(BLE) Class I/Class II 36-Pin; Category: UNK; Device Class L3: Transceivers; Device Class L1: Integrated Circuits (ICs)
R5-R8 = CRGH0603J10K: RES SMD 10K OHM 5% 1/5W 0603; Manufacturer: TE Connectivity Passive Product; Power (Watts): 0.2W, 1/5W; Temperature Coefficient: ±100ppm/°C; Part Number: CRGH0603J10K; Value: 10 kOhms; ComponentLink1Description: Datasheet; ComponentLink1URL: https://www.te.com/commerce/DocumentDelivery/DDEController?Action=srchrtrv&DocNm=1773204-1&DocType=DS&DocLang=English; ComponentLink2Description: DigiKey Link; ComponentLink2URL: https://www.digikey.com/en/products/detail/te-connectivity-passive-product/CRGH0603J10K/2385379; Composition: Thick Film; Device Package: 0603 (1608 Metric); LastUpdated: 2022-07-10 9:21:30 AM; Lifecycle Status: Active; Minimum Order: 1; Number of Terminations: 2; Operating Temperature: -55°C ~ 155°C; Package / Case: 0603 (1608 Metric); Packaging: TapeAndReel; PartId: 22457; Part Status: Active; Price: 0.01; Resistance: 10 kOhms; Series: CRGH, Neohm; Size / Dimension: 0.063" L x 0.031" W (1.60mm x 0.80mm); Supplier 1: DigiKey; Supplier Part Number 1: A126394CT-ND; Supplier Device Package: 0603; Tolerance: ±5%
R9 R10 = ESR03EZPF1001: RES SMD 1K OHM 1% 1/4W 0603; Manufacturer: Rohm Semiconductor; Power (Watts): 0.25W, 1/4W; Temperature Coefficient: ±100ppm/°C; Part Number: ESR03EZPF1001; Value: 1 kOhms; ComponentLink1Description: Datasheet; ComponentLink1URL: https://www.rohm.com/datasheet/ESR01MZPF/esr-e; ComponentLink2Description: DigiKey Link; ComponentLink2URL: https://www.digikey.com/en/products/detail/rohm-semiconductor/ESR03EZPF1001/1983428; Composition: Thick Film; Device Package: 0603 (1608 Metric); Features: Automotive AEC-Q200, Pulse Withstanding; Height - Seated (Max): 0.022" (0.55mm); LastUpdated: 2022-07-15 11:50:24 AM; Lifecycle Status: Active; Minimum Order: 1; Number of Terminations: 2; Operating Temperature: -55°C ~ 155°C; Package / Case: 0603 (1608 Metric); Packaging: TapeAndReel; PartId: 5469; Part Status: Active; Price: 0.01; Ratings: AEC-Q200; Resistance: 1 kOhms; Series: ESR; Size / Dimension: 0.063" L x 0.031" W (1.60mm x 0.80mm); Supplier 1: DigiKey; Supplier Part Number 1: RHM1.00KADCT-ND; Supplier Device Package: 0603; Tolerance: ±1%
R11 = ERJ-3EKF2400V: RES SMD 240 OHM 1% 1/10W 0603; Manufacturer: Panasonic Electronic Components; Power (Watts): 0.1W, 1/10W; Temperature Coefficient: ±100ppm/°C; Part Number: ERJ-3EKF2400V; Value: 240 Ohms; ComponentLink1Description: Datasheet; ComponentLink1URL: https://industrial.panasonic.com/cdbs/www-data/pdf/RDA0000/AOA0000C304.pdf; ComponentLink2Description: DigiKey Link; ComponentLink2URL: https://www.digikey.com/en/products/detail/panasonic-electronic-components/ERJ-3EKF2400V/1746342; Composition: Thick Film; Device Package: 0603 (1608 Metric); Features: Automotive AEC-Q200; Height - Seated (Max): 0.022" (0.55mm); LastUpdated: 2022-07-15 11:49:17 AM; Lifecycle Status: Active; Minimum Order: 1; Number of Terminations: 2; Operating Temperature: -55°C ~ 155°C; Package / Case: 0603 (1608 Metric); Packaging: TapeAndReel; PartId: 23069; Part Status: Active; Price: 0.01; Ratings: AEC-Q200; Resistance: 240 Ohms; Series: ERJ-3EK; Size / Dimension: 0.063" L x 0.031" W (1.60mm x 0.80mm); Supplier 1: DigiKey; Supplier Part Number 1: P240HCT-ND; Supplier Device Package: 0603; Tolerance: ±1%
R? = CMP-26527-006958-1: 1MΩ ±1% 0.1W 0603 Thick Film Chip Resistor AEC-Q200 compliant; Resistance: 1MR; Working Voltage: 75V; Temperature Coefficient: 100ppm/°C; Power Rating: 100mW; Series: RMCF; Case/Package: 0603; Packaging: Tape and Reel; Technology: THICK FILM; Depth: 0.8mm; Contact Plating: Tin; Lead Free: Lead Free; Mount: Surface Mount; Features: Automotive AEC-Q200; Construction: Rectangular; Length: 1.55mm; Tolerance: 1%; Resistor Type: Thick Film; Max Power Dissipation: 100mW; Case Code (Imperial): 0603; Height: 0.022inch; Max Operating Temperature: 155°C; Radiation Hardening: No; Width: 0.031inch; Min Operating Temperature: -55°C; Military Standard: Not; Number of Terminations: 2; Case Code (Metric): 1608; RoHS Compliant: Yes
U1 = MCIMX7D7DVK10SD: Integrated Circuit; Manufacturer_Name: NXP; Datasheet Link: https://www.nxp.com/docs/en/data-sheet/IMX7DCEC.pdf; Height: 1.1mm; Manufacturer_Part_Number: MCIMX7D7DVK10SD; Mouser Part Number: 771-MCIMX7D7DVK10SD; Mouser Price/Stock: https://www.mouser.co.uk/ProductDetail/NXP-Semiconductors/MCIMX7D7DVK10SD?qs=HXFqYaX1Q2wSzmbkM61K9A%3D%3D
X? = CMP-2000-05036-1: Low Frequency Crystal, 32.768 KHz, 6 pF, +/- 20 ppm, -40 to 85 degC, 4-Pin SMD, RoHS, Tape and Reel; Manufacturer: Abracon; Tolerance: 20PPM; ESR: 50kOhms; Case Width: 3.8mm; Case Height: 2.5mm; Case Length: 8mm; Load Capacitance: 6pF; Operating Temperature Range: -40Cto+85C; Package Reference: ABS25; Factory Pack Quantity: 3000; Package Description: 4-Pin Surface Mount Device, Body 8 x 3.8 mm, Pitch 5.5 mm; Frequency: 32.768kHz; Termination Style: SMD/SMT; Manufacturer URL: http://www.abracon.com/; Type: LowFrequencyCrystal; Dimensions: 3.8mmWx8mmLx2.5mmH; Product Category: Crystals; Series: ABS25; RoHS: Details; Package / Case: 8mmx3.8mm; Datasheet Version: Jun-17; Brand: ABRACON; Datasheet URL: https://datasheet.ciiva.com/854/abs25-854528.pdf; Packaging: Reel; Mounting Style: SMD/SMT
Y?#1 = CMP-27762-000009-3: XTAL Oscillator 32.768kHz ±25ppm CMOS 3.3V 4-SMD 3.2mm x 2.5mm; Max Supply Current: 3.5mA; Min Supply Voltage: 2.97V; Load Capacitance: 15pF; Max Supply Voltage: 3.63V; Series: ASEK; Frequency: 32.768kHz; Operating Supply Voltage: 3.3V; Max Operating Temperature: 85°C; Case/Package: SMD/SMT; Frequency Stability: 25ppm; Depth: 2.5mm; Lead Free: Lead Free; Min Operating Temperature: -40°C; Termination: SMD/SMT; Length: 3.2mm; REACH SVHC: No SVHC; Mount: Surface Mount; Number of Pins: 4; Radiation Hardening: No; Operating Frequency: 32.768 kHz; Height: 0.047inch; Packaging: Tape and Reel; Width: 0.098inch
Y?#2 = CMP-27762-013688-1: Crystal 24MHz ±20ppm 18pF SMD-2 5mm x 3.2mm; Series Resistance: 30R; Frequency Stability: 30ppm; Length: 5mm; Frequency Tolerance: 20ppm; Height: 0.051inch; Number of Pins: 2; Lead Free: Lead Free; Tolerance: 20ppm; Resistor Type: Ceramic; Case/Package: CSMD; Mount: Surface Mount; Series: ABM3; Min Operating Temperature: -40°C; Operating Frequency: 24 MHz; Package Quantity: 1000; Width: 0.126inch; ESR (Equivalent Series Resistance): 30R; Packaging: Tape and Reel; Frequency: 24MHz; RoHS Compliant: Yes; Termination: SMD/SMT; Load Capacitance: 18pF; Max Operating Temperature: 85°C; Depth: 3.2mm